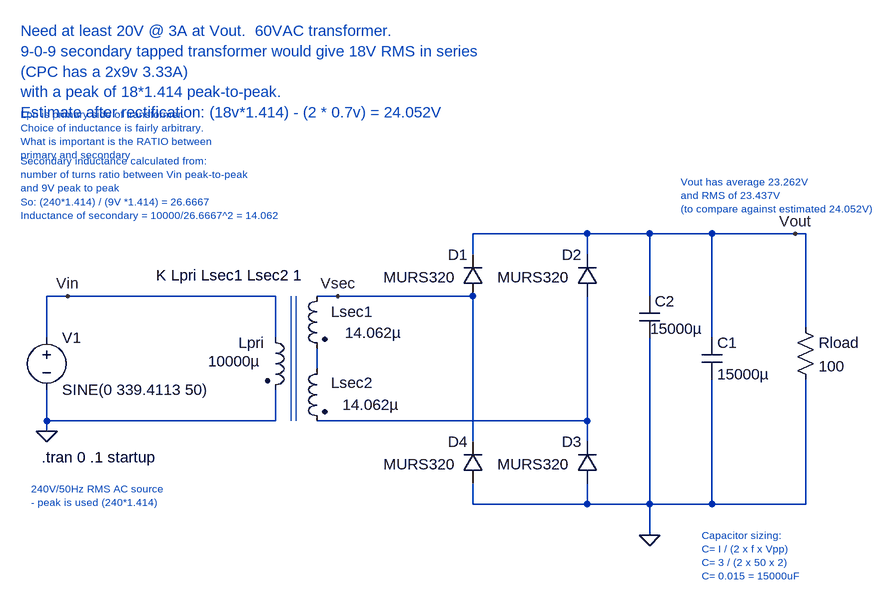
[diagram p0: schematic PowerStage.asc]
PowerStage.asc, the LTspice schematic file:
Version 4
SHEET 1 1572 680
WIRE 896 96 720 96
WIRE 992 96 896 96
WIRE 1088 96 992 96
WIRE 1216 96 1088 96
WIRE 1232 96 1216 96
WIRE 720 128 720 96
WIRE 896 128 896 96
WIRE 96 192 64 192
WIRE 416 192 96 192
WIRE 512 192 480 192
WIRE 720 192 512 192
WIRE 992 192 992 96
WIRE 1232 240 1232 96
WIRE 64 256 64 192
WIRE 416 256 416 192
WIRE 1088 256 1088 96
WIRE 480 304 480 272
WIRE 64 384 64 336
WIRE 416 384 416 336
WIRE 416 384 64 384
WIRE 896 384 896 192
WIRE 896 384 480 384
WIRE 64 400 64 384
WIRE 720 416 720 192
WIRE 896 416 896 384
WIRE 720 512 720 480
WIRE 896 512 896 480
WIRE 896 512 720 512
WIRE 992 512 992 256
WIRE 992 512 896 512
WIRE 1088 512 1088 320
WIRE 1088 512 992 512
WIRE 1232 512 1232 320
WIRE 1232 512 1088 512
WIRE 992 560 992 512
FLAG 64 400 0
FLAG 992 560 0
FLAG 96 192 Vin
FLAG 512 192 Vsec
FLAG 1216 96 Vout
SYMBOL voltage 64 240 R0
SYMATTR InstName V1
SYMATTR Value SINE(0 339.4113 50)
SYMATTR SpiceLine Rser=.0001
SYMBOL ind2 400 240 R0
WINDOW 0 -41 24 Left 2
WINDOW 3 -88 52 Left 2
SYMATTR InstName Lpri
SYMATTR Value 10000µ
SYMATTR Type ind
SYMBOL ind2 496 176 M0
WINDOW 0 -70 40 Left 2
WINDOW 3 -115 72 Left 2
SYMATTR InstName Lsec1
SYMATTR Value 14.062µ
SYMATTR Type ind
SYMBOL ind2 496 288 M0
WINDOW 0 -70 37 Left 2
WINDOW 3 -111 71 Left 2
SYMATTR InstName Lsec2
SYMATTR Value 14.062µ
SYMATTR Type ind
SYMBOL res 1216 224 R0
SYMATTR InstName Rload
SYMATTR Value 100
SYMBOL diode 736 192 R180
WINDOW 0 24 64 Left 2
WINDOW 3 43 29 Left 2
SYMATTR InstName D1
SYMATTR Value MURS320
SYMBOL cap 1072 256 R0
SYMATTR InstName C1
SYMATTR Value 15000µ
SYMATTR SpiceLine V=472MRH mfg="   ---" pn="   ---" type="   ---"
SYMBOL diode 912 192 R180
WINDOW 0 24 64 Left 2
WINDOW 3 43 29 Left 2
SYMATTR InstName D2
SYMATTR Value MURS320
SYMBOL diode 912 480 R180
WINDOW 0 24 64 Left 2
WINDOW 3 43 29 Left 2
SYMATTR InstName D3
SYMATTR Value MURS320
SYMBOL diode 736 480 R180
WINDOW 0 24 64 Left 2
WINDOW 3 43 29 Left 2
SYMATTR InstName D4
SYMATTR Value MURS320
SYMBOL cap 976 192 R0
WINDOW 3 17 50 Left 2
SYMATTR Value 15000µ
SYMATTR InstName C2
SYMATTR SpiceLine V=472MRH mfg="   ---" pn="   ---" type="   ---"
TEXT 56 440 Left 2 !.tran 0 .1 startup
TEXT 232 160 Left 2 !K Lpri Lsec1 Lsec2 1
TEXT 40 488 Left 1 ;240V/50Hz RMS AC source \n- peak is used (240*1.414)
TEXT 24 -88 Left 1 ;Lpri is primary side of transformer.  \nChoice of inductance is fairly arbitrary.\nWhat is important is the RATIO between\nprimary and secondary
TEXT 24 -216 Left 2 ;Need at least 20V @ 3A at Vout.  60VAC transformer.\n9-0-9 secondary tapped transformer would give 18V RMS in series\n(CPC has a 2x9v 3.33A)\nwith a peak of 18*1.414 peak-to-peak.\nEstimate after rectification: (18v*1.414) - (2 * 0.7v) = 24.052V
TEXT 24 -16 Left 1 ;Secondary inductance calculated from:\nnumber of turns ratio between Vin peak-to-peak \nand 9V peak to peak\nSo: (240*1.414) / (9V *1.414) = 26.6667\nInductance of secondary = 10000/26.6667^2 = 14.062
TEXT 1040 16 Left 1 ;Vout has average 23.262V \nand RMS of 23.437V\n(to compare against estimated 24.052V)
TEXT 1072 560 Left 1 ;Capacitor sizing:\nC= I / (2 x f x Vpp)\nC= 3 / (2 x 50 x 2)\nC= 0.015 = 15000uF
LINE Normal 448 192 448 384
LINE Normal 440 384 440 192

The netlist it stands for:
* PowerStage.asc
V1 Vin 0 SINE(0 339.4113 50) Rser=.0001
Lpri Vin 0 10000µ
Lsec1 Vsec N001 14.062µ
Lsec2 N001 N002 14.062µ
Rload Vout 0 100
D1 Vsec Vout MURS320
C1 Vout 0 15000µ V=472MRH mfg="   ---" pn="   ---" type="   ---"
D2 N002 Vout MURS320
D3 0 N002 MURS320
D4 0 Vsec MURS320
C2 Vout 0 15000µ V=472MRH mfg="   ---" pn="   ---" type="   ---"
.model D D
.lib standard.dio
.tran 0 .1 startup
K Lpri Lsec1 Lsec2 1
* 240V/50Hz RMS AC source
* - peak is used (240*1.414)
* Lpri is primary side of transformer.
* Choice of inductance is fairly arbitrary.
* What is important is the RATIO between
* primary and secondary
* Need at least 20V @ 3A at Vout.  60VAC transformer.
* 9-0-9 secondary tapped transformer would give 18V RMS in series
* (CPC has a 2x9v 3.33A)
* with a peak of 18*1.414 peak-to-peak.
* Estimate after rectification: (18v*1.414) - (2 * 0.7v) = 24.052V
* Secondary inductance calculated from:
* number of turns ratio between Vin peak-to-peak
* and 9V peak to peak
* So: (240*1.414) / (9V *1.414) = 26.6667
* Inductance of secondary = 10000/26.6667^2 = 14.062
* Vout has average 23.262V
* and RMS of 23.437V
* (to compare against estimated 24.052V)
* Capacitor sizing:
* C= I / (2 x f x Vpp)
* C= 3 / (2 x 50 x 2)
* C= 0.015 = 15000uF
.backanno
.end